# EAGLE design Simplified 4 ch sample-and-hold without mux v2.0 (EAGLE 9.6.2)
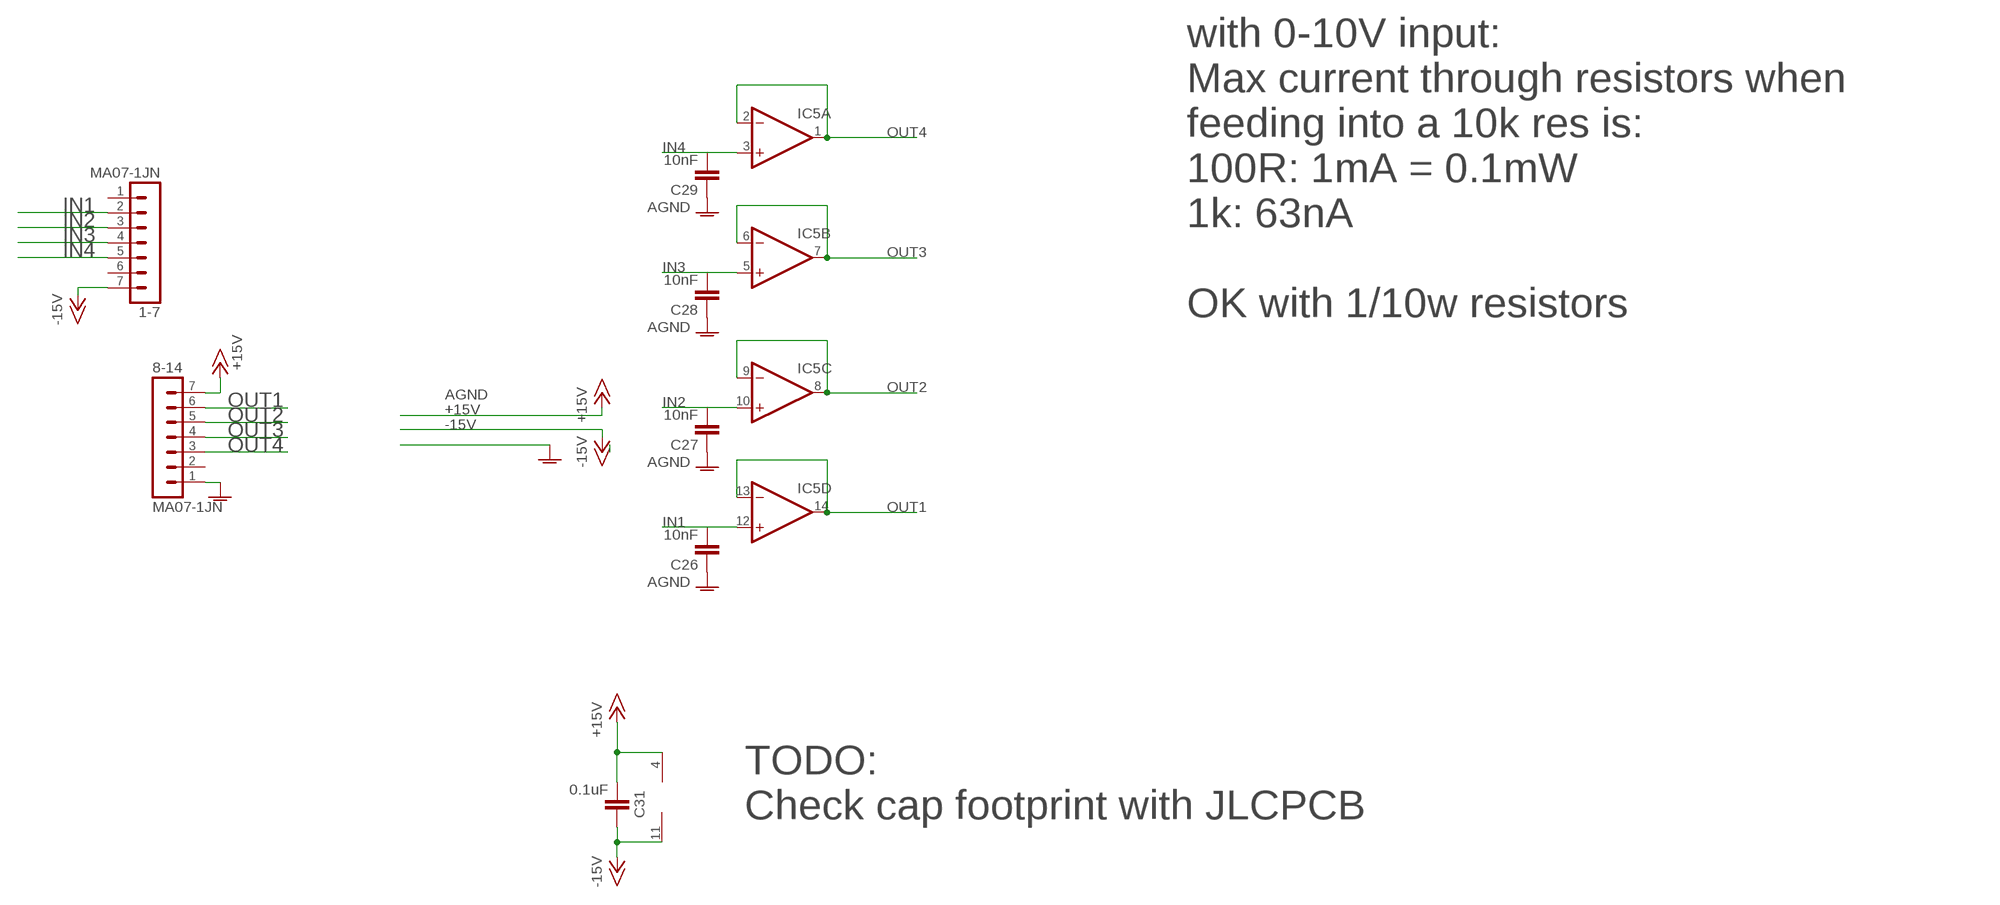
[diagram p0: schematic, sheet 1]

## Parts
1-7  MA07-1JN  [MA07N-1J]
8-14  MA07-1JN  [MA07N-1J]
C26  10nF  C-EUC0805  [C0805]
C27  10nF  C-EUC0805  [C0805]
C28  10nF  C-EUC0805  [C0805]
C29  10nF  C-EUC0805  [C0805]
C31  0.1uF  C-EUC0603  [C0603]
IC5  TL084CPWR  TL074JT  [TSSOP14J]

## Nets
+15V: 8-14.7 C31.1 IC5.4(P:V+)
-15V: 1-7.7 C31.2 IC5.11(P:V-)
AGND: 8-14.1 C26.1 C27.1 C28.1 C29.1
IN1: 1-7.2 C26.2 IC5.12(D:+IN)
IN2: 1-7.3 C27.2 IC5.10(C:+IN)
IN3: 1-7.4 C28.2 IC5.5(B:+IN)
IN4: 1-7.5 C29.2 IC5.3(A:+IN)
OUT1: 8-14.6 IC5.13(D:-IN) IC5.14(D:OUT)
OUT2: 8-14.5 IC5.8(C:OUT) IC5.9(C:-IN)
OUT3: 8-14.4 IC5.6(B:-IN) IC5.7(B:OUT)
OUT4: 8-14.3 IC5.1(A:OUT) IC5.2(A:-IN)
Unconnected: 1-7.1 1-7.6 8-14.2

## Notes on the sheet
- with 0-10V input:
  Max current through resistors when
  feeding into a 10k res is:
  100R: 1mA = 0.1mW
  1k: 63nA
  
  OK with 1/10w resistors
- TODO: 
  Check cap footprint with JLCPCB

## Library data of the parts
1-7 8-14 = joakim:MA07-1J
C26-C29 = rcl:C-EU: CAPACITOR, European symbol; SPICEPREFIX: C
C31 = resistor:C-EU: CAPACITOR, European symbol
IC5 = joakim:TL074J: OP AMP

## Board
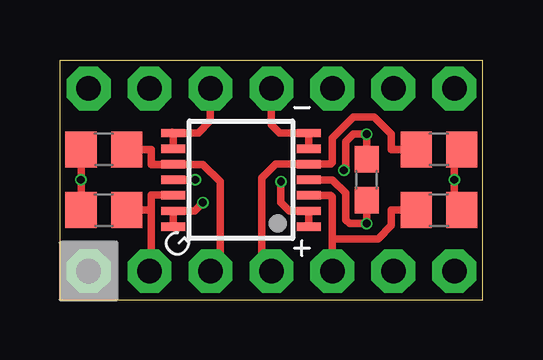
[diagram p1: board, top side]
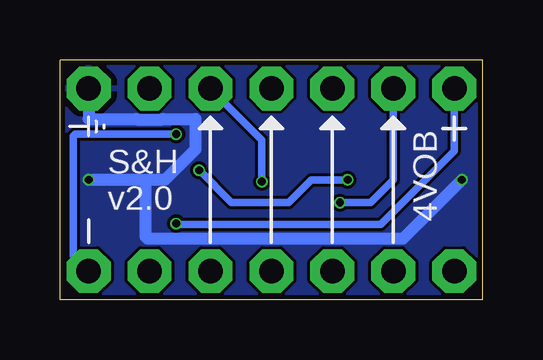
[diagram p2: board, bottom side, seen from below]

Size 17.62 x 10 mm. Coordinates in mm from the lower left corner, seen from the top.
Outline: 0,0 17.62,0 17.62,10 0,10 0,0
Copper layers (1*16): Top 0.035mm / dielectric 1.6mm / Bottom 0.035mm
Design rules "jlcpcb-2layers": minimum track width 5mil, minimum drill 0.3mm, track to track 5mil, track to pad 5mil, pad to pad 5mil, via to via 5mil, smd to smd 5mil, copper to edge 0.2mm, drill to drill 6mil, minimum pad ring 10mil, minimum via ring 3mil, stop-mask expansion 4mil, vias tented up to drill 0mil, thermal gap 10mil

### Footprints (pad centres in the part's own frame; a part is rotated, then mirrored left to right if it is on the bottom)
MA07N-1J = drill 1.016 octagon: 1 -7.62,0; 2 -5.08,0; 3 -2.54,0; 4 0,0; 5 2.54,0; 6 5.08,0; 7 7.62,0
C0805 = smd 1.3 x 1.5: 1 -0.95,0; 2 0.95,0
C0603 = smd 1.1 x 1: 1 -0.85,0; 2 0.85,0
TSSOP14J = smd 0.35 x 1: 1 -1.95,-2.825; 2 -1.3,-2.825; 3 -0.65,-2.825; 4 0,-2.825; 5 0.65,-2.825; 6 1.3,-2.825; 7 1.95,-2.825; 8 1.95,2.825; 9 1.3,2.825; 10 0.65,2.825; 11 0,2.825; 12 -0.65,2.825; 13 -1.3,2.825; 14 -1.95,2.825

### Placement (x,y rotation side)
1-7  8.81,1.19 0 top
8-14  8.81,8.81 180 top
C26  1.83,3.73 0 top
C27  1.83,6.27 0 top
C28  15.8,6.27 180 top
C29  15.8,3.73 180 top
C31  12.78,5 90 top
IC5  TL074JT  [TSSOP14J]  7.54,5 90 top

### Tracks (layer width: path | path; a pad name or v marks a point on that pad's centre or on a via)
+15V  (via drill 0.33)
  Top 0.305: IC5.4 11.35,5 11.91,4.45 11.91,3.33 12.06,3.17 v12.78,3.17 C31.1
  Bottom 0.305: 8-14.7 1.19,6.19 4.25,3.13 12.74,3.13 v12.78,3.17
-15V  (via drill 0.33)
  Top 0.305: v5.64,5 IC5.11 | C31.2 v12.78,6.91 12.22,6.91 11.91,6.59 11.91,5.48 v11.83,5.4
  Bottom 0.305: v5.64,5 7.14,5 8.1,4.05 10.48,4.05 v11.83,5.4 | 1-7.7 17.07,1.83 17.07,6.83 16.99,6.91 v12.78,6.91
AGND  (via drill 0.33)
  Top 0.305: C27.1 v0.88,5 | v0.88,5 v0.87,5 | C28.1 16.43,5.96 v16.43,5 16.43,4.05 C29.1 | C26.1 v0.88,5
  Bottom 0.508: v0.87,5 3.33,2.54 13.97,2.54 14.05,2.62 14.05,5 | 8-14.1 16.43,7.54 14.45,7.54 14.43,7.51 13.35,7.51 13.33,7.54 11.99,7.54 11.99,6.27 13.26,5 14.05,5 | 14.05,5 v16.43,5
  pour Bottom: 0,10.08 17.7,10.08 17.7,-0.08 -0.08,-0.08 -0.08,10.08
IN1
  Top 0.305: C26.2 3.81,3.73 | 3.81,3.73 3.81,4.37 4.7,4.37 IC5.12 | 1-7.2 3.81,1.27 3.81,3.73
IN2
  Top 0.305: C27.2 3.81,6.27 3.81,5.64 4.7,5.64 IC5.10 4.73,5.64 5.95,5.64 6.67,4.92 6.67,1.59 1-7.3
IN3
  Top 0.305: 10.35,5.64 IC5.5 | 1-7.4 8.41,1.59 8.41,5.08 8.98,5.65 IC5.5 | IC5.5 11.29,5.65 11.35,5.71 11.35,6.75 12.22,7.62 13.1,7.62 13.81,6.91 13.81,6.27 C28.2
IN4
  Top 0.305: 10.35,4.37 IC5.3 11.29,4.35 11.35,4.29 1-7.5 11.35,2.46 11.43,2.54 13.26,2.54 13.81,3.1 13.81,3.73 C29.2
OUT1  (via drill 0.33)
  Top 0.305: 4.68,3.02 IC5.14 IC5.13 5.61,3.7 v5.95,4.05
  Bottom 0.305: v5.95,4.05 4.68,4.05 3.73,5 8-14.6
OUT2
  Top 0.305: 4.68,6.99 IC5.8 | IC5.8 IC5.9 | IC5.8 5.76,6.95 6.27,7.46 8-14.5
OUT3
  Top 0.305: IC5.6 IC5.7 9.16,6.95 8.81,7.3 8-14.4
OUT4  (via drill 0.33)
  Top 0.305: IC5.1 IC5.2 9.55,3.7 9.21,4.05 v9.21,4.92
  Bottom 0.305: v9.21,4.92 9.21,6.67 8-14.3

### Text on the board
tNames: G
bNames: S&H / v2.0 | 4VOB